# EAGLE schematic assembly (EAGLE 9.6.2)

## Parts
C1  100n  C  [C_0603]  (not placed on a sheet)
R1  10k  R  [R_0603]
R2  10k  R  [R_0603]

## Library data of the parts
C1 = Test:C
R1 R2 = Test:R; LCSC: C25804